# Altium schematic sheet Top.SchDoc
size A4
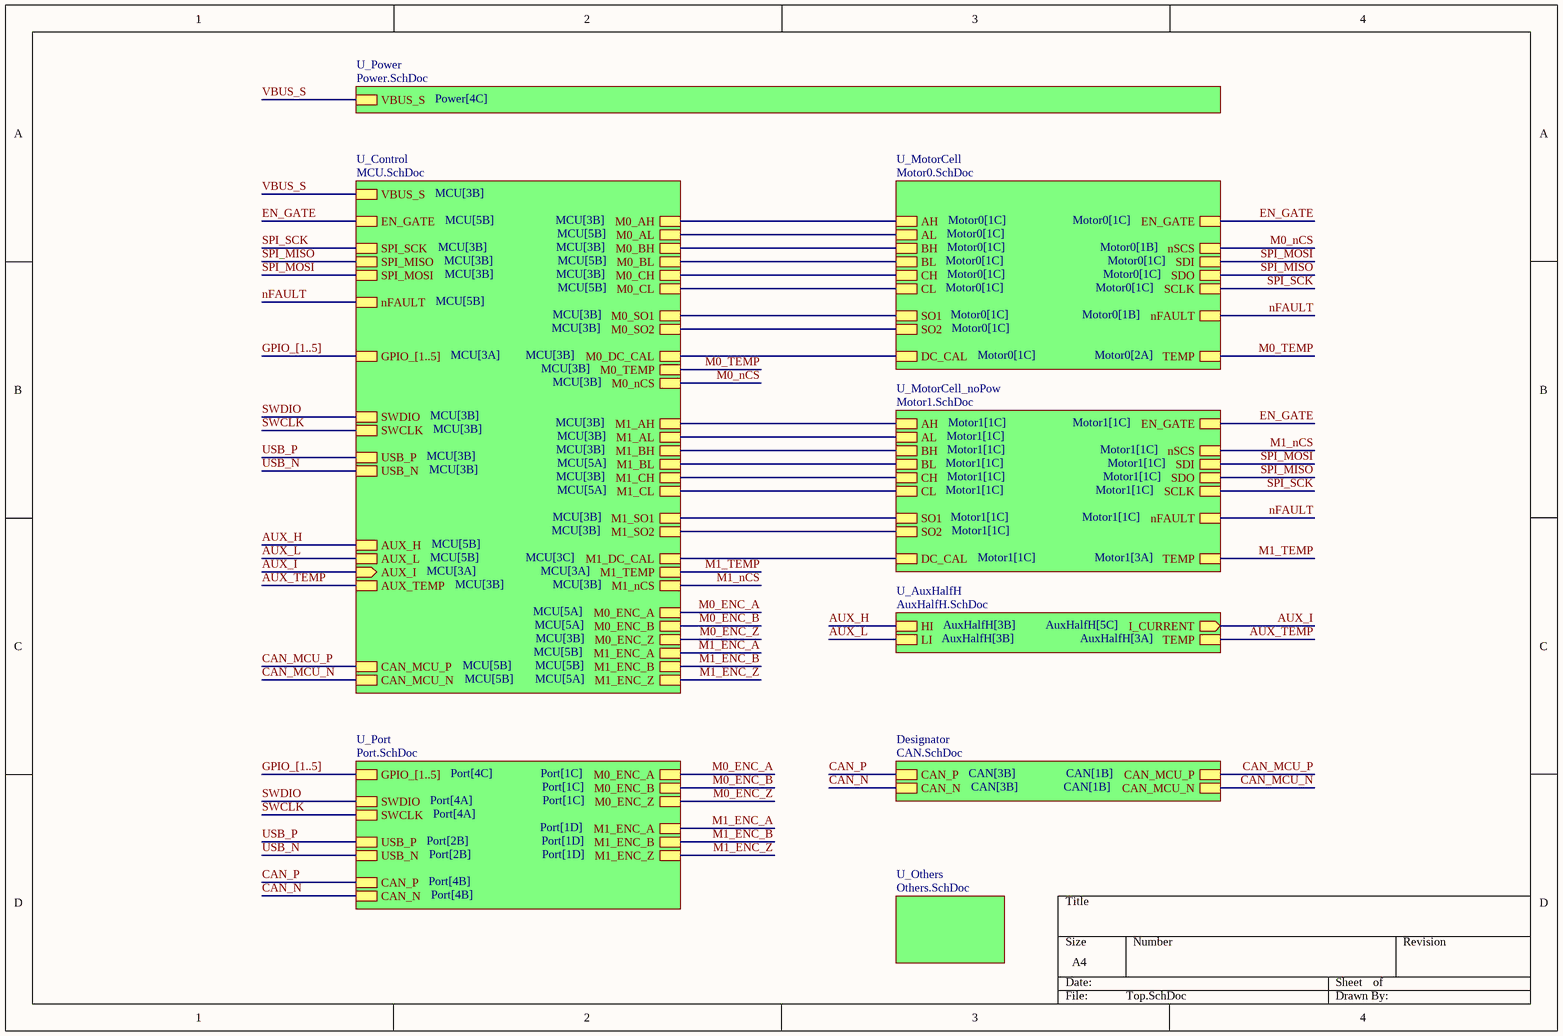
[diagram p0: Top.SchDoc]

## Sub-sheets
Designator = CAN.SchDoc: CAN_P, CAN_N, CAN_MCU_P, CAN_MCU_N
U_AuxHalfH = AuxHalfH.SchDoc: HI, LI, I_CURRENT (out), TEMP
U_Control = MCU.SchDoc: VBUS_S, M1_AL, M0_AH, M0_BH, M0_CH, M0_SO1, M0_SO2, M1_SO2, M1_SO1, AUX_TEMP, M0_TEMP, M1_AH, M1_BH, M1_CH, M0_DC_CAL, M1_BL, M1_CL, EN_GATE, AUX_L, AUX_H, M0_AL, M0_BL, M0_CL, nFAULT, M1_DC_CAL, M0_nCS, M1_nCS, AUX_I (in), M1_TEMP, SPI_SCK, SPI_MISO, SPI_MOSI, GPIO_[1..5], SWDIO, SWCLK, USB_N, USB_P, M1_ENC_Z, M0_ENC_A, M0_ENC_B, M1_ENC_A, M1_ENC_B, M0_ENC_Z, CAN_MCU_P, CAN_MCU_N
U_MotorCell = Motor0.SchDoc: nFAULT, EN_GATE, AH, AL, BH, BL, CH, CL, DC_CAL, SDI, SDO, SCLK, nSCS, SO1, SO2, TEMP
U_MotorCell_noPow = Motor1.SchDoc: nFAULT, EN_GATE, AH, AL, BH, BL, CH, CL, DC_CAL, SDI, SDO, SCLK, nSCS, TEMP, SO1, SO2
U_Others = Others.SchDoc: no entries
U_Port = Port.SchDoc: GPIO_[1..5], SWDIO, SWCLK, CAN_P, CAN_N, M1_ENC_A, M1_ENC_B, M1_ENC_Z, M0_ENC_A, M0_ENC_B, M0_ENC_Z, USB_N, USB_P
U_Power = Power.SchDoc: VBUS_S

## Nets
AUX_H: sheet U_AuxHalfH/HI, sheet U_Control/AUX_H
AUX_I: sheet U_AuxHalfH/I_CURRENT, sheet U_Control/AUX_I
AUX_L: sheet U_AuxHalfH/LI, sheet U_Control/AUX_L
AUX_TEMP: sheet U_AuxHalfH/TEMP, sheet U_Control/AUX_TEMP
CAN_MCU_N: sheet U_Control/CAN_MCU_N, sheet Designator/CAN_MCU_N
CAN_MCU_P: sheet U_Control/CAN_MCU_P, sheet Designator/CAN_MCU_P
CAN_N: sheet U_Port/CAN_N, sheet Designator/CAN_N
CAN_P: sheet U_Port/CAN_P, sheet Designator/CAN_P
EN_GATE: sheet U_Control/EN_GATE, sheet U_MotorCell/EN_GATE, sheet U_MotorCell_noPow/EN_GATE
M0_ENC_A: sheet U_Control/M0_ENC_A, sheet U_Port/M0_ENC_A
M0_ENC_B: sheet U_Control/M0_ENC_B, sheet U_Port/M0_ENC_B
M0_ENC_Z: sheet U_Control/M0_ENC_Z, sheet U_Port/M0_ENC_Z
M0_nCS: sheet U_Control/M0_nCS, sheet U_MotorCell/nSCS
M0_TEMP: sheet U_Control/M0_TEMP, sheet U_MotorCell/TEMP
M1_ENC_A: sheet U_Control/M1_ENC_A, sheet U_Port/M1_ENC_A
M1_ENC_B: sheet U_Control/M1_ENC_B, sheet U_Port/M1_ENC_B
M1_ENC_Z: sheet U_Control/M1_ENC_Z, sheet U_Port/M1_ENC_Z
M1_nCS: sheet U_Control/M1_nCS, sheet U_MotorCell_noPow/nSCS
M1_TEMP: sheet U_Control/M1_TEMP, sheet U_MotorCell_noPow/TEMP
nFAULT: sheet U_Control/nFAULT, sheet U_MotorCell/nFAULT, sheet U_MotorCell_noPow/nFAULT
SPI_MISO: sheet U_Control/SPI_MISO, sheet U_MotorCell/SDO, sheet U_MotorCell_noPow/SDO
SPI_MOSI: sheet U_Control/SPI_MOSI, sheet U_MotorCell/SDI, sheet U_MotorCell_noPow/SDI
SPI_SCK: sheet U_Control/SPI_SCK, sheet U_MotorCell/SCLK, sheet U_MotorCell_noPow/SCLK
SWCLK: sheet U_Control/SWCLK, sheet U_Port/SWCLK
SWDIO: sheet U_Control/SWDIO, sheet U_Port/SWDIO
USB_N: sheet U_Control/USB_N, sheet U_Port/USB_N
USB_P: sheet U_Control/USB_P, sheet U_Port/USB_P
VBUS_S: sheet U_Control/VBUS_S, sheet U_Power/VBUS_S
(unnamed): sheet U_Control/M1_AL, sheet U_MotorCell_noPow/AL
(unnamed): sheet U_Control/M0_AH, sheet U_MotorCell/AH
(unnamed): sheet U_Control/M0_BH, sheet U_MotorCell/BH
(unnamed): sheet U_Control/M0_CH, sheet U_MotorCell/CH
(unnamed): sheet U_Control/M0_SO1, sheet U_MotorCell/SO1
(unnamed): sheet U_Control/M0_SO2, sheet U_MotorCell/SO2
(unnamed): sheet U_Control/M1_SO2, sheet U_MotorCell_noPow/SO2
(unnamed): sheet U_Control/M1_SO1, sheet U_MotorCell_noPow/SO1
(unnamed): sheet U_Control/M1_AH, sheet U_MotorCell_noPow/AH
(unnamed): sheet U_Control/M1_BH, sheet U_MotorCell_noPow/BH
(unnamed): sheet U_Control/M1_CH, sheet U_MotorCell_noPow/CH
(unnamed): sheet U_Control/M0_DC_CAL, sheet U_MotorCell/DC_CAL
(unnamed): sheet U_Control/M1_BL, sheet U_MotorCell_noPow/BL
(unnamed): sheet U_Control/M1_CL, sheet U_MotorCell_noPow/CL
(unnamed): sheet U_Control/M0_AL, sheet U_MotorCell/AL
(unnamed): sheet U_Control/M0_BL, sheet U_MotorCell/BL
(unnamed): sheet U_Control/M0_CL, sheet U_MotorCell/CL
(unnamed): sheet U_Control/M1_DC_CAL, sheet U_MotorCell_noPow/DC_CAL

## Buses and harness runs
bus GPIO_[1..5] = sheet U_Control/GPIO_[1..5]
bus GPIO_[1..5] = sheet U_Port/GPIO_[1..5]